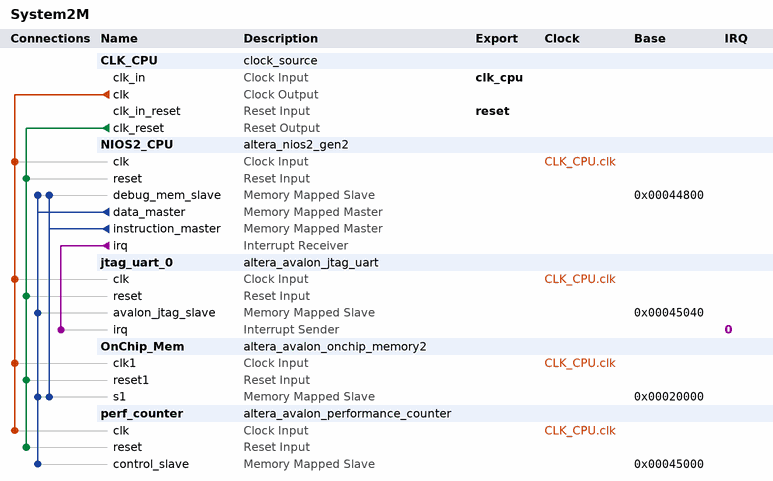
[diagram p0: system contents]
# Platform Designer (Qsys) system System2M, MAX 10 10M50DAF484C7G
# Parameters at their usual value, and those the tool derives, are not listed.
package require -exact qsys 18.1
create_system System2M
set_project_property DEVICE_FAMILY {MAX 10}
set_project_property DEVICE 10M50DAF484C7G

add_instance CLK_CPU clock_source 18.1
set_instance_parameter_value CLK_CPU clockFrequency 50000000

add_instance NIOS2_CPU altera_nios2_gen2 18.1
set_instance_parameter_value NIOS2_CPU dcache_size 2048
set_instance_parameter_value NIOS2_CPU exceptionSlave OnChip_Mem.s1
set_instance_parameter_value NIOS2_CPU icache_size 4096
set_instance_parameter_value NIOS2_CPU impl Tiny
set_instance_parameter_value NIOS2_CPU resetSlave OnChip_Mem.s1

add_instance jtag_uart_0 altera_avalon_jtag_uart 18.1
set_instance_parameter_value jtag_uart_0 simInteractiveOptions NO_INTERACTIVE_WINDOWS

add_instance OnChip_Mem altera_avalon_onchip_memory2 18.1
set_instance_parameter_value OnChip_Mem dataWidth 32
set_instance_parameter_value OnChip_Mem dualPort false
set_instance_parameter_value OnChip_Mem initMemContent false
set_instance_parameter_value OnChip_Mem initializationFileName onchip_mem.hex
set_instance_parameter_value OnChip_Mem memorySize 131072

add_instance perf_counter altera_avalon_performance_counter 18.1
set_instance_parameter_value perf_counter numberOfSections 3

# connections
add_connection CLK_CPU.clk jtag_uart_0.clk clock
add_connection CLK_CPU.clk NIOS2_CPU.clk clock
add_connection CLK_CPU.clk OnChip_Mem.clk1 clock
add_connection CLK_CPU.clk perf_counter.clk clock
add_connection CLK_CPU.clk_reset jtag_uart_0.reset reset
add_connection CLK_CPU.clk_reset NIOS2_CPU.reset reset
add_connection CLK_CPU.clk_reset OnChip_Mem.reset1 reset
add_connection CLK_CPU.clk_reset perf_counter.reset reset
add_connection NIOS2_CPU.data_master jtag_uart_0.avalon_jtag_slave avalon
set_connection_parameter_value NIOS2_CPU.data_master/jtag_uart_0.avalon_jtag_slave baseAddress 0x00045040
add_connection NIOS2_CPU.data_master NIOS2_CPU.debug_mem_slave avalon
set_connection_parameter_value NIOS2_CPU.data_master/NIOS2_CPU.debug_mem_slave baseAddress 0x00044800
add_connection NIOS2_CPU.data_master OnChip_Mem.s1 avalon
set_connection_parameter_value NIOS2_CPU.data_master/OnChip_Mem.s1 baseAddress 0x00020000
add_connection NIOS2_CPU.data_master perf_counter.control_slave avalon
set_connection_parameter_value NIOS2_CPU.data_master/perf_counter.control_slave baseAddress 0x00045000
add_connection NIOS2_CPU.instruction_master NIOS2_CPU.debug_mem_slave avalon
set_connection_parameter_value NIOS2_CPU.instruction_master/NIOS2_CPU.debug_mem_slave baseAddress 0x00044800
add_connection NIOS2_CPU.instruction_master OnChip_Mem.s1 avalon
set_connection_parameter_value NIOS2_CPU.instruction_master/OnChip_Mem.s1 baseAddress 0x00020000
add_connection NIOS2_CPU.irq jtag_uart_0.irq interrupt
set_connection_parameter_value NIOS2_CPU.irq/jtag_uart_0.irq irqNumber 0

# exported interfaces
add_interface clk_cpu clock sink
set_interface_property clk_cpu EXPORT_OF CLK_CPU.clk_in
add_interface reset reset sink
set_interface_property reset EXPORT_OF CLK_CPU.clk_in_reset

set_interconnect_requirement {$system} qsys_mm.clockCrossingAdapter HANDSHAKE
set_interconnect_requirement {$system} qsys_mm.enableEccProtection FALSE
set_interconnect_requirement {$system} qsys_mm.insertDefaultSlave FALSE
set_interconnect_requirement {$system} qsys_mm.maxAdditionalLatency 1

save_system System2M.qsys
